# EAGLE schematic mippe_32u4 (EAGLE 9.5.1)

## Sheet 1 of 2
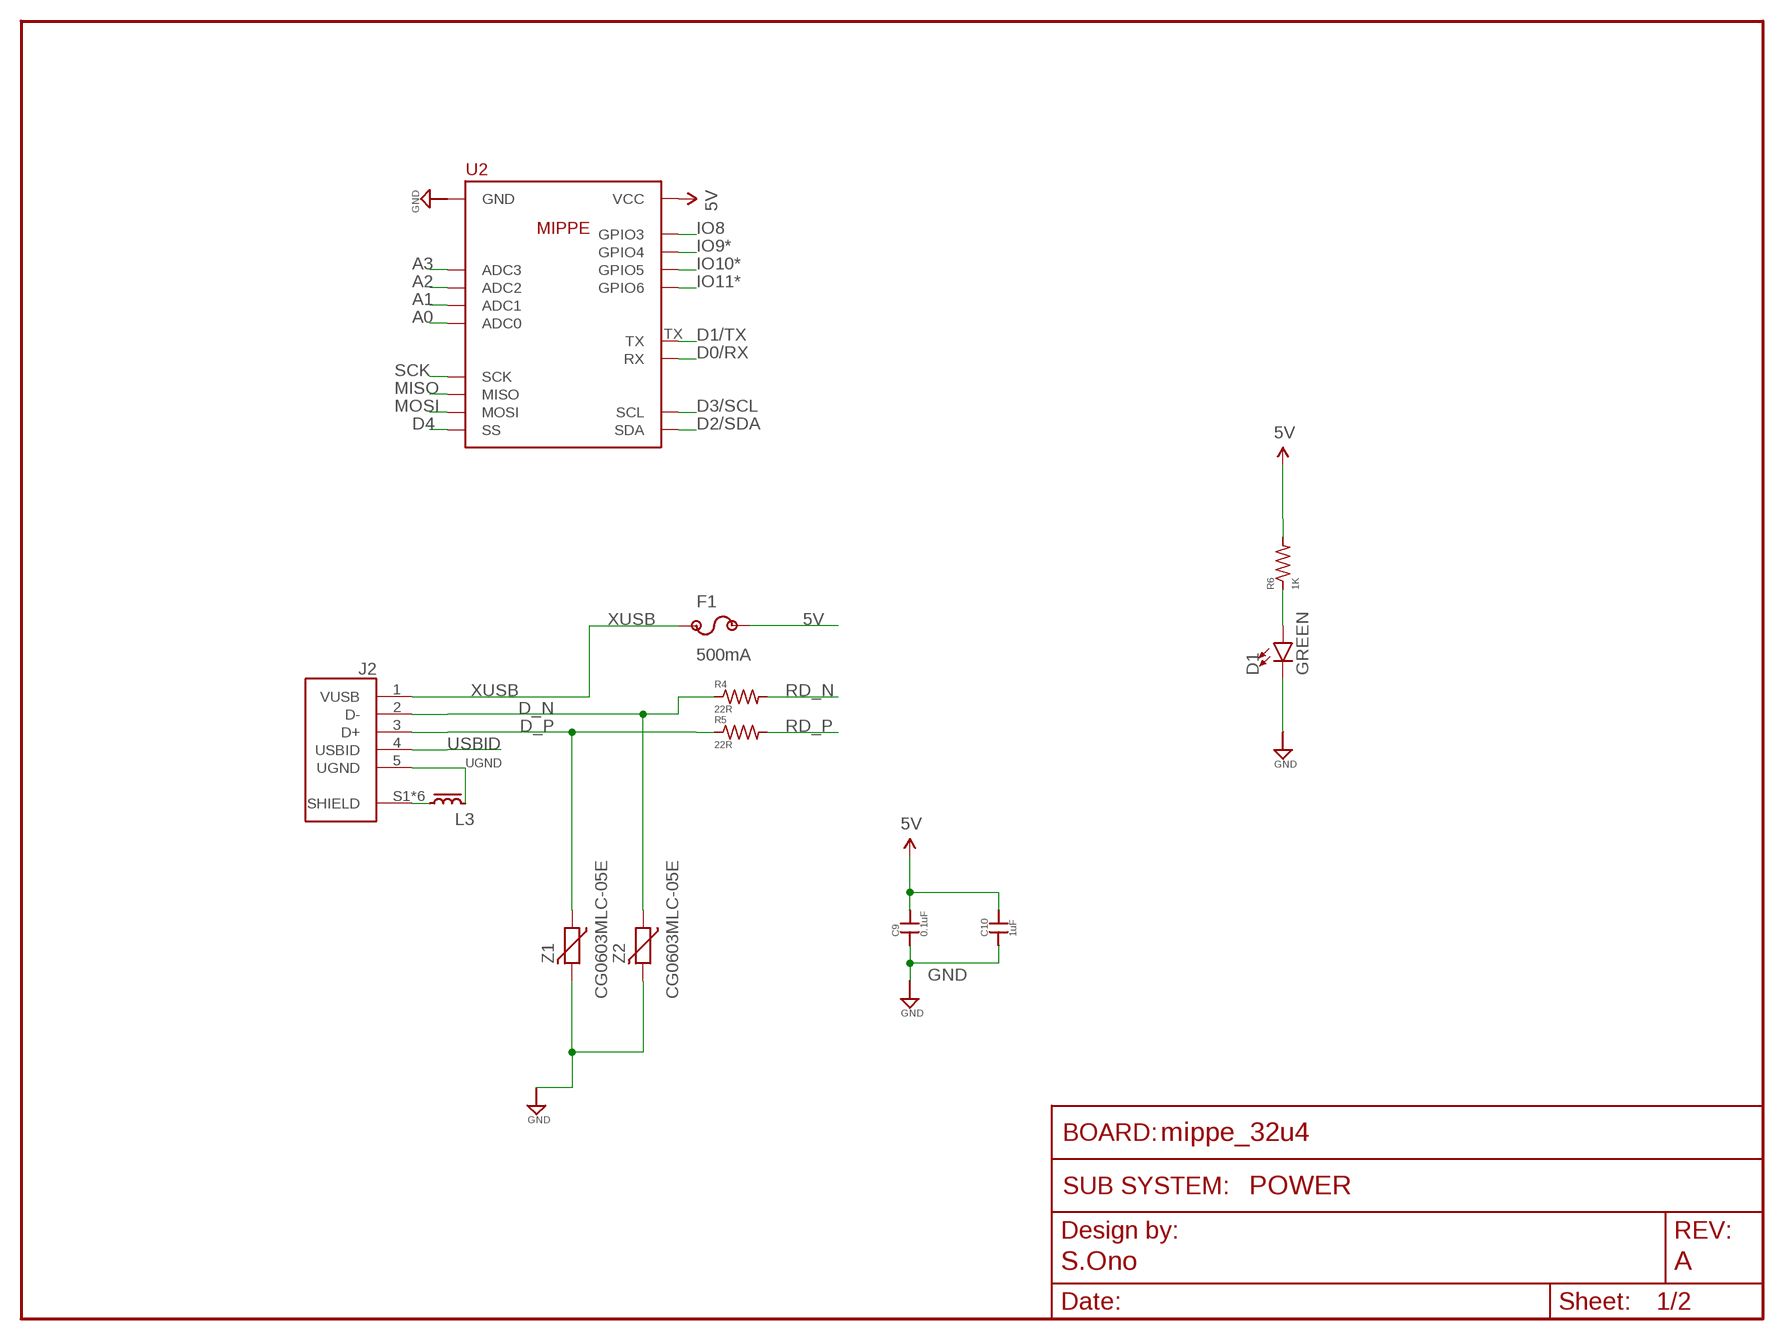
[diagram p0: schematic, sheet 1]
FRAME2 (FRAME_SCHEMATIC): AUTHOR: S.Ono; REV: A; SUBSYSTEM_NAME: POWER

### Parts
C9  0.1uF  CAP0603-CAP  [0603-CAP]
C10  1uF  CAP0603-CAP  [0603-CAP]
D1  GREEN  LED0603  [LED-0603]
F1  500mA  0ZCJ0050FF2G1206  [1206]
J2  USB  [FCI_10103594-0001LF]
L3  IND  [IND_2012]
R4  22R  R-US_0603  [0603-RES]
R5  22R  R-US_0603  [0603-RES]
R6  1K  R-US_0603  [0603-RES]
U2  MIPPE  [MIPPE]
Z1  CG0603MLC-05E  VARISTOR  [0603-RES]
Z2  CG0603MLC-05E  VARISTOR  [0603-RES]

### Nets
5V [power]: C9.2 C10.2 F1.2 R6.2 U2.VCC U2.VCC@1(VCC) ; also sheet 2
A0: U2.ADC0 ; also sheet 2
A1: U2.ADC1 ; also sheet 2
A2: U2.ADC2 ; also sheet 2
A3: U2.ADC3 ; also sheet 2
D0/RX: U2.RX ; also sheet 2
D1/TX: U2.TX ; also sheet 2
D2/SDA: U2.SDA ; also sheet 2
D3/SCL: U2.SCL ; also sheet 2
D4: U2.SS ; also sheet 2
D_N [diff pairs]: J2.2(D-) R4.1 Z2.1
D_P [diff pairs]: J2.3(D+) R5.1 Z1.1
GND [gnd]: C9.1 C10.1 D1.C U2.GND@0(GND) U2.GND@1(GND) Z1.2 Z2.2 ; also sheet 2
IO8: U2.GPIO3 ; also sheet 2
IO9*: U2.GPIO4 ; also sheet 2
IO10*: U2.GPIO5 ; also sheet 2
IO11*: U2.GPIO6 ; also sheet 2
MISO: U2.MISO ; also sheet 2
MOSI: U2.MOSI ; also sheet 2
N$3: D1.A R6.1
RD_N [diff pairs]: R4.2 ; also sheet 2
RD_P [diff pairs]: R5.2 ; also sheet 2
SCK: U2.SCK ; also sheet 2
SHIELD: J2.S1(SHIELD) J2.S2(SHIELD) J2.S3(SHIELD) J2.S4(SHIELD) J2.S5(SHIELD) J2.S6(SHIELD) L3.1
UGND [gnd]: J2.5(UGND) L3.2 ; also sheet 2
USBID: J2.4(USBID)
XUSB: F1.1 J2.1(VUSB)

## Sheet 2 of 2
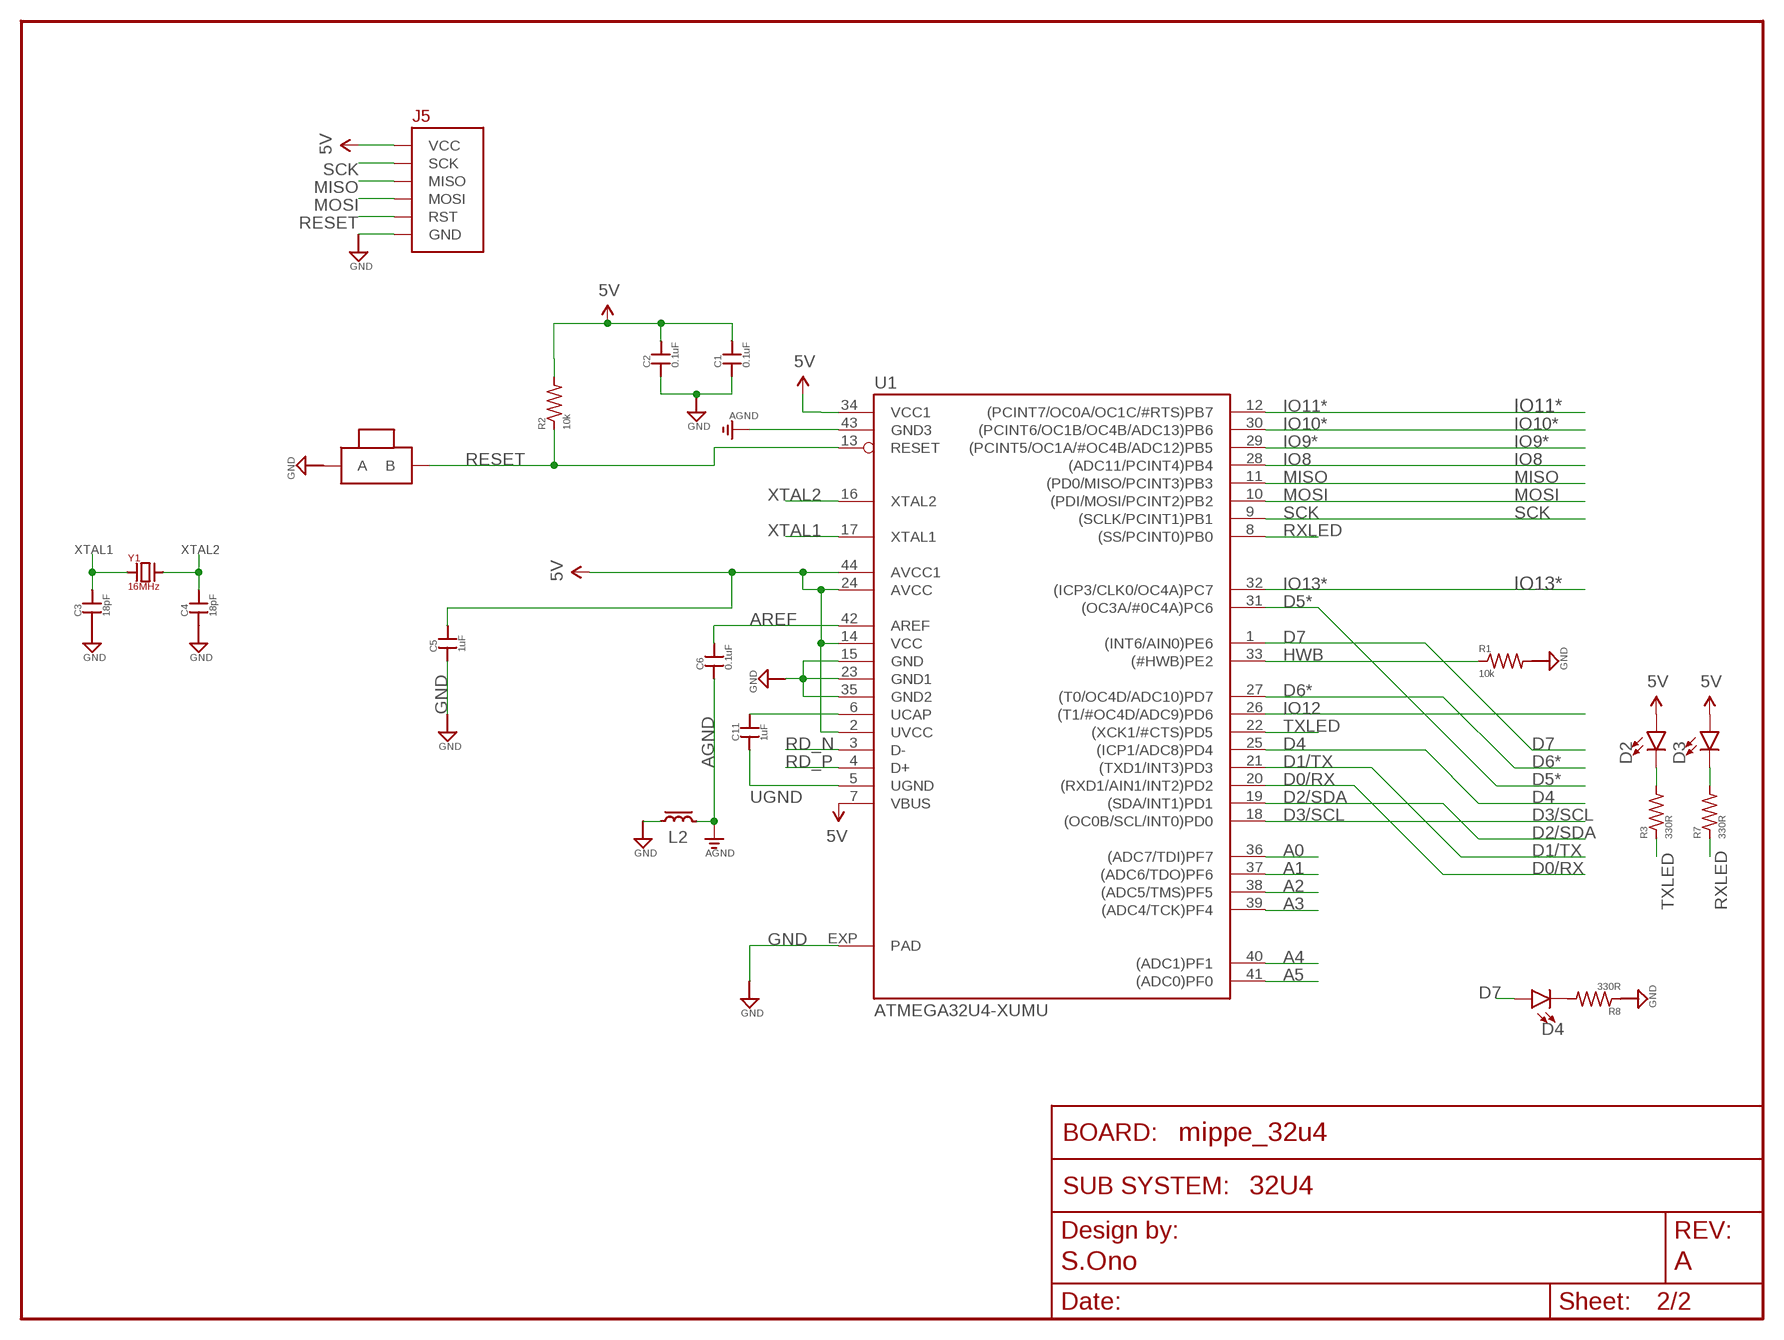
[diagram p1: schematic, sheet 2]
FRAME1 (FRAME_SCHEMATIC): AUTHOR: S.Ono; REV: A; SUBSYSTEM_NAME: 32U4

### Parts
C1  0.1uF  CAP0603-CAP  [0603-CAP]
C2  0.1uF  CAP0603-CAP  [0603-CAP]
C3  18pF  CAP0603-CAP  [0603-CAP]
C4  18pF  CAP0603-CAP  [0603-CAP]
C5  1uF  CAP0603-CAP  [0603-CAP]
C6  0.1uF  CAP0603-CAP  [0603-CAP]
C11  1uF  CAP0603-CAP  [0603-CAP]
D2  LED0603  [LED-0603]
D3  LED0603  [LED-0603]
D4  LED0603  [LED-0603]
J5  BURNIN  [BURNIN]
L2  IND  [IND_2012]
R1  10k  R-US_0603  [0603-RES]
R2  10k  R-US_0603  [0603-RES]
R3  330R  R-US_0603  [0603-RES]
R7  330R  R-US_0603  [0603-RES]
R8  330R  R-US_0603  [0603-RES]
SW1  BTN-PTS810  [BTN_PTS810]
U1  ATMEGA32U4-XUMU  [QFN44ML7X7]
Y1  16MHz  CRYSTAL_SMOL  [XTAL500X320X130N]

### Nets
5V [power]: C1.2 C2.2 C5.2 D2.A D3.A J5.3.3V(VCC) R2.2 U1.2(UVCC) U1.7(VBUS) U1.14(VCC) U1.24(AVCC) U1.34(VCC1) U1.44(AVCC1) ; also sheet 1
A0: U1.36((ADC7/TDI)PF7) ; also sheet 1
A1: U1.37((ADC6/TDO)PF6) ; also sheet 1
A2: U1.38((ADC5/TMS)PF5) ; also sheet 1
A3: U1.39((ADC4/TCK)PF4) ; also sheet 1
A4: U1.40((ADC1)PF1)
A5: U1.41((ADC0)PF0)
AGND: C6.1 L2.2 U1.43(GND3)
AREF [aref]: C6.2 U1.42(AREF)
D0/RX: U1.20((RXD1/AIN1/INT2)PD2) ; also sheet 1
D1/TX: U1.21((TXD1/INT3)PD3) ; also sheet 1
D2/SDA: U1.19((SDA/INT1)PD1) ; also sheet 1
D3/SCL: U1.18((OC0B/SCL/INT0)PD0) ; also sheet 1
D4: U1.25((ICP1/ADC8)PD4) ; also sheet 1
D5*: U1.31((OC3A/#0C4A)PC6)
D6*: U1.27((T0/OC4D/ADC10)PD7)
D7: D4.A U1.1((INT6/AIN0)PE6)
GND [gnd]: C1.1 C2.1 C3.1 C4.1 C5.1 J5.GND L2.1 R1.2 R8.1 SW1.1(A) SW1.2(A) U1.15(GND) U1.23(GND1) U1.35(GND2) U1.EXP(PAD) ; also sheet 1
HWB: R1.1 U1.33((#HWB)PE2)
IO8: U1.28((ADC11/PCINT4)PB4) ; also sheet 1
IO9*: U1.29((PCINT5/OC1A/#OC4B/ADC12)PB5) ; also sheet 1
IO10*: U1.30((PCINT6/OC1B/OC4B/ADC13)PB6) ; also sheet 1
IO11*: U1.12((PCINT7/OC0A/OC1C/#RTS)PB7) ; also sheet 1
IO12: U1.26((T1/#OC4D/ADC9)PD6)
IO13*: U1.32((ICP3/CLK0/OC4A)PC7)
MISO: J5.MISO U1.11((PD0/MISO/PCINT3)PB3) ; also sheet 1
MOSI: J5.MOSI U1.10((PDI/MOSI/PCINT2)PB2) ; also sheet 1
N$1: D2.C R3.2
N$2: D3.C R7.2
N$4: D4.C R8.2
RD_N [diff pairs]: U1.3(D-) ; also sheet 1
RD_P [diff pairs]: U1.4(D+) ; also sheet 1
RESET: J5.RST R2.1 SW1.3(B) SW1.4(B) U1.13(RESET)
RXLED: R7.1 U1.8((SS/PCINT0)PB0)
SCK: J5.SCK U1.9((SCLK/PCINT1)PB1) ; also sheet 1
TXLED: R3.1 U1.22((XCK1/#CTS)PD5)
UCAP: C11.2 U1.6(UCAP)
UGND [gnd]: C11.1 U1.5(UGND) ; also sheet 1
XTAL1: C3.2 U1.17(XTAL1) Y1.1(A)
XTAL2: C4.2 U1.16(XTAL2) Y1.2(B)

## Library data of the parts
C1-C6 C9-C11 = scono:CAP: Capacitor Standard 0603 ceramic capacitor, and 0.1" leaded capacitor.; PIE-INT-REF-NUM: CAPACITOR-GENERIC
D1-D4 = scono:LED: https://www.digikey.com/products/en/optoelectronics/led-indication-discrete/105?k=&pkeyword=&pv7=2&pv1989=0&pv16=5&FV=ffe00069&quantity=0&ColumnSort=0&page=1&pageSize=25
F1 = scono:0ZCJ0050FF2G: https://www.digikey.com/product-detail/en/bel-fuse-inc/0ZCJ0050FF2G/507-1802-1-ND/4156236
J2 = scono:USB: Micro Usb, 2.0 Type b, Receptacle, Smt; DESCRIPTION: Micro Usb, 2.0 Type b, Receptacle, Smt; DIGI-KEY_PART_NUMBER: 609-4050-1-ND; DIGI-KEY_PURCHASE_URL: https://www.digikey.com/product-detail/en/amphenol-icc-fci/10103594-0001LF/609-4050-1-ND/2350357?utm_source=snapeda&utm_medium=aggregator&utm_campaign=symbol; MF: Amphenol ICC; MP: 10103594-0001LF; PACKAGE: None
J5 = scono:BURNIN
L2 L3 = scono:IND; MANUFACTURER_PART_NUMBER: MLZ2012M1R0HT000; VENDOR: TDK
R1-R8 = scono:R-US_: RESISTOR, American symbol
SW1 = scono:BTN-PTS810: https://www.digikey.com/product-detail/en/c-k/PTS810-SJM-250-SMTR-LFS/CKN10502CT-ND/4176673
U1 = scono:ATMEGA32U4-XU
U2 = scono:MIPPE
Y1 = scono:CRYSTAL
Z1 Z2 = scono:VARISTOR: VARISTOR

## Net classes
0 default: width 0.152 mm, drill 0.381 mm, clearance 0.152 mm
1 power: width 0.254 mm, drill 0.499 mm, clearance 0.152 mm to class 0, clearance 0.254 mm
2 gnd: width 0.254 mm, drill 0.499 mm, clearance 0.152 mm to class 0, clearance 0.152 mm to class 1, clearance 0.254 mm
3 usbvcc: width 0.254 mm, drill 0.499 mm, clearance 0.152 mm to class 0, clearance 0.152 mm to class 1, clearance 0.152 mm to class 2, clearance 0.254 mm
4 aref: width 0.254 mm, drill 0.499 mm, clearance 0.152 mm to class 0, clearance 0.152 mm to class 1, clearance 0.152 mm to class 2, clearance 0.152 mm to class 3, clearance 0.254 mm
5 diff pairs: width 0.152 mm, clearance 0.152 mm to class 0, clearance 0.152 mm to class 1, clearance 0.152 mm to class 2, clearance 0.152 mm to class 3, clearance 0.152 mm to class 4, clearance 0.152 mm